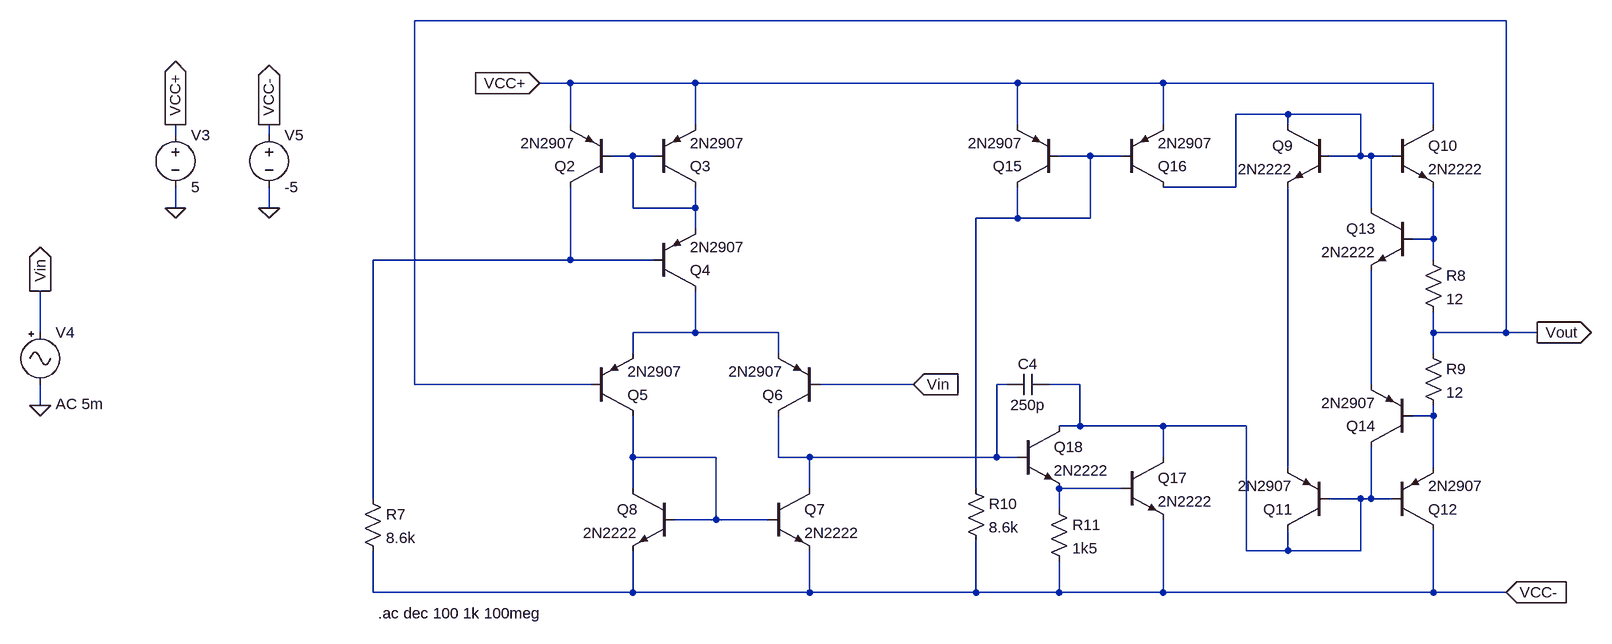
[diagram p0: schematic Draft11.asc]
Draft11.asc, the LTspice schematic file:
Version 4
SHEET 1 880 1400
WIRE -208 384 -1888 384
WIRE -1648 480 -1696 480
WIRE -1456 480 -1648 480
WIRE -960 480 -1456 480
WIRE -736 480 -960 480
WIRE -320 480 -736 480
WIRE -544 528 -624 528
WIRE -432 528 -544 528
WIRE -1648 544 -1648 480
WIRE -1456 544 -1456 480
WIRE -960 544 -960 480
WIRE -736 544 -736 480
WIRE -544 544 -544 528
WIRE -320 544 -320 480
WIRE -2256 560 -2256 544
WIRE -2112 560 -2112 544
WIRE -1552 592 -1584 592
WIRE -1520 592 -1552 592
WIRE -848 592 -896 592
WIRE -800 592 -848 592
WIRE -432 592 -432 528
WIRE -432 592 -480 592
WIRE -416 592 -432 592
WIRE -384 592 -416 592
WIRE -624 640 -624 528
WIRE -624 640 -736 640
WIRE -2256 672 -2256 640
WIRE -2112 672 -2112 640
WIRE -1552 672 -1552 592
WIRE -1456 672 -1456 640
WIRE -1456 672 -1552 672
WIRE -416 672 -416 592
WIRE -960 688 -960 640
WIRE -960 688 -1024 688
WIRE -848 688 -848 592
WIRE -848 688 -960 688
WIRE -1456 704 -1456 672
WIRE -320 720 -320 640
WIRE -320 720 -352 720
WIRE -1648 752 -1648 640
WIRE -1648 752 -1952 752
WIRE -1520 752 -1648 752
WIRE -320 752 -320 720
WIRE -2464 864 -2464 800
WIRE -1456 864 -1456 800
WIRE -1456 864 -1552 864
WIRE -1328 864 -1456 864
WIRE -320 864 -320 832
WIRE -208 864 -208 384
WIRE -208 864 -320 864
WIRE -160 864 -208 864
WIRE -1552 896 -1552 864
WIRE -1328 896 -1328 864
WIRE -320 896 -320 864
WIRE -1888 944 -1888 384
WIRE -1616 944 -1888 944
WIRE -1120 944 -1264 944
WIRE -976 944 -992 944
WIRE -864 944 -912 944
WIRE -416 944 -416 768
WIRE -2464 976 -2464 944
WIRE -320 992 -320 976
WIRE -320 992 -352 992
WIRE -864 1008 -864 944
WIRE -864 1008 -896 1008
WIRE -736 1008 -864 1008
WIRE -608 1008 -736 1008
WIRE -1552 1056 -1552 992
WIRE -1424 1056 -1552 1056
WIRE -1328 1056 -1328 992
WIRE -1280 1056 -1328 1056
WIRE -992 1056 -992 944
WIRE -992 1056 -1280 1056
WIRE -960 1056 -992 1056
WIRE -736 1056 -736 1008
WIRE -544 1072 -544 640
WIRE -320 1072 -320 992
WIRE -1552 1104 -1552 1056
WIRE -1280 1104 -1280 1056
WIRE -1024 1104 -1024 688
WIRE -800 1104 -896 1104
WIRE -1952 1120 -1952 752
WIRE -432 1120 -480 1120
WIRE -416 1120 -416 1040
WIRE -416 1120 -432 1120
WIRE -384 1120 -416 1120
WIRE -896 1136 -896 1104
WIRE -1424 1152 -1424 1056
WIRE -1424 1152 -1488 1152
WIRE -1344 1152 -1424 1152
WIRE -608 1200 -608 1008
WIRE -544 1200 -544 1168
WIRE -544 1200 -608 1200
WIRE -432 1200 -432 1120
WIRE -432 1200 -544 1200
WIRE -1952 1264 -1952 1200
WIRE -1552 1264 -1552 1200
WIRE -1552 1264 -1952 1264
WIRE -1280 1264 -1280 1200
WIRE -1280 1264 -1552 1264
WIRE -1024 1264 -1024 1184
WIRE -1024 1264 -1280 1264
WIRE -896 1264 -896 1216
WIRE -896 1264 -1024 1264
WIRE -736 1264 -736 1152
WIRE -736 1264 -896 1264
WIRE -320 1264 -320 1168
WIRE -320 1264 -736 1264
WIRE -208 1264 -320 1264
FLAG -2112 672 0
FLAG -160 864 Vout
IOPIN -160 864 Out
FLAG -2464 976 0
FLAG -208 1264 VCC-
IOPIN -208 1264 In
FLAG -2112 544 VCC-
IOPIN -2112 544 Out
FLAG -2256 672 0
FLAG -2256 544 VCC+
IOPIN -2256 544 Out
FLAG -2464 800 Vin
IOPIN -2464 800 Out
FLAG -1696 480 VCC+
IOPIN -1696 480 In
FLAG -1120 944 Vin
IOPIN -1120 944 In
SYMBOL voltage -2256 544 R0
SYMATTR InstName V3
SYMATTR Value 5
SYMBOL pnp -1584 640 R180
SYMATTR InstName Q2
SYMATTR Value 2N2907
SYMBOL pnp -1520 640 M180
SYMATTR InstName Q3
SYMATTR Value 2N2907
SYMBOL pnp -1520 800 M180
SYMATTR InstName Q4
SYMATTR Value 2N2907
SYMBOL pnp -1616 992 M180
SYMATTR InstName Q5
SYMATTR Value 2N2907
SYMBOL pnp -1264 992 R180
SYMATTR InstName Q6
SYMATTR Value 2N2907
SYMBOL res -1968 1104 R0
SYMATTR InstName R7
SYMATTR Value 8.6k
SYMBOL npn -1344 1104 R0
SYMATTR InstName Q7
SYMATTR Value 2N2222
SYMBOL npn -1488 1104 M0
SYMATTR InstName Q8
SYMATTR Value 2N2222
SYMBOL Misc/signal -2464 848 R0
WINDOW 3 24 104 Invisible 2
WINDOW 123 24 126 Left 2
SYMATTR InstName V4
SYMATTR Value SINE()
SYMATTR Value2 AC 5m
SYMBOL npn -480 544 M0
SYMATTR InstName Q9
SYMATTR Value 2N2222
SYMBOL npn -384 544 R0
SYMATTR InstName Q10
SYMATTR Value 2N2222
SYMBOL pnp -480 1168 R180
SYMATTR InstName Q11
SYMATTR Value 2N2907
SYMBOL pnp -384 1168 M180
SYMATTR InstName Q12
SYMATTR Value 2N2907
SYMBOL voltage -2112 544 R0
SYMATTR InstName V5
SYMATTR Value -5
SYMBOL npn -352 672 M0
SYMATTR InstName Q13
SYMATTR Value 2N2222
SYMBOL res -336 736 R0
SYMATTR InstName R8
SYMATTR Value 12
SYMBOL pnp -352 1040 R180
SYMATTR InstName Q14
SYMATTR Value 2N2907
SYMBOL res -336 880 R0
SYMATTR InstName R9
SYMATTR Value 12
SYMBOL pnp -896 640 R180
SYMATTR InstName Q15
SYMATTR Value 2N2907
SYMBOL pnp -800 640 M180
SYMATTR InstName Q16
SYMATTR Value 2N2907
SYMBOL npn -800 1056 R0
SYMATTR InstName Q17
SYMATTR Value 2N2222
SYMBOL npn -960 1008 R0
SYMATTR InstName Q18
SYMATTR Value 2N2222
SYMBOL res -1040 1088 R0
SYMATTR InstName R10
SYMATTR Value 8.6k
SYMBOL res -912 1120 R0
SYMATTR InstName R11
SYMATTR Value 1k5
SYMBOL cap -912 928 R90
WINDOW 0 0 32 VBottom 2
WINDOW 3 32 32 VTop 2
SYMATTR InstName C4
SYMATTR Value 250p
TEXT -1944 1296 Left 2 !.ac dec 100 1k 100meg

The netlist it stands for:
* Draft11.asc
V3 VCC+ 0 5
Q2 N005 N002 VCC+ 0 2N2907
Q3 N002 N002 VCC+ 0 2N2907
Q4 N006 N005 N002 0 2N2907
Q5 N011 Vout N006 0 2N2907
Q6 N007 Vin N006 0 2N2907
R7 N005 VCC- 8.6k
Q7 N007 N011 VCC- 0 2N2222
Q8 N011 N011 VCC- 0 2N2222
V4 Vin 0 SINE() AC 5m
Q9 N001 N001 N012 0 2N2222
Q10 VCC+ N001 N004 0 2N2222
Q11 N008 N008 N012 0 2N2907
Q12 VCC- N008 N010 0 2N2907
V5 VCC- 0 -5
Q13 N001 N004 N009 0 2N2222
R8 N004 Vout 12
Q14 N008 N010 N009 0 2N2907
R9 Vout N010 12
Q15 N003 N003 VCC+ 0 2N2907
Q16 N001 N003 VCC+ 0 2N2907
Q17 N008 N013 VCC- 0 2N2222
Q18 N008 N007 N013 0 2N2222
R10 N003 VCC- 8.6k
R11 N013 VCC- 1k5
C4 N008 N007 250p
.model NPN NPN
.model PNP PNP
.lib standard.bjt
.ac dec 100 1k 100meg
.backanno
.end